# Altium schematic sheet schematic.schdoc
size 190 x 158 mm
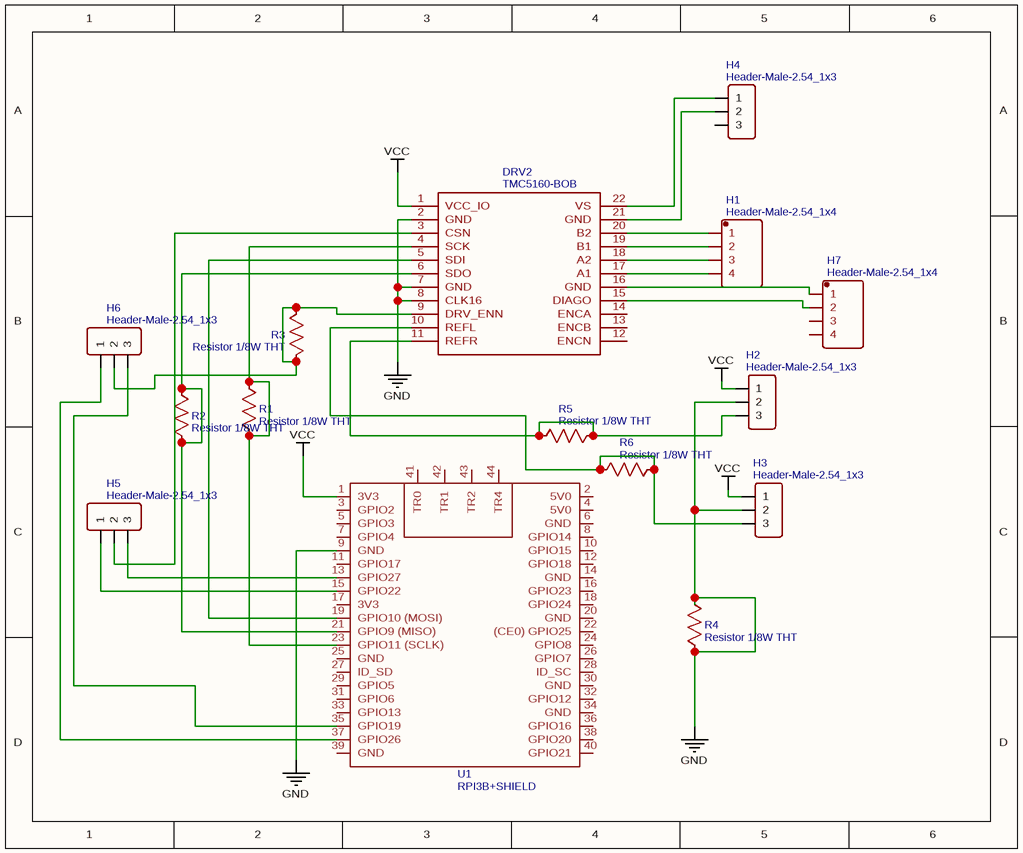
[diagram p0: schematic.schdoc]

## Parts
DRV2  TMC5160-BOB  [TMC5160-BOB]
H1  Header-Male-2.54_1x4  [HDR-TH_4P-P2.54-V]
H2  Header-Male-2.54_1x3  [HDR-TH_3P-P2.54-V]
H3  Header-Male-2.54_1x3  [HDR-TH_3P-P2.54-V]
H4  Header-Male-2.54_1x3  [HDR-TH_3P-P2.54-V]
H5  Header-Male-2.54_1x3  [HDR-TH_3P-P2.54-V]
H6  Header-Male-2.54_1x3  [HDR-TH_3P-P2.54-V]
H7  Header-Male-2.54_1x4  [HDR-TH_4P-P2.54-V]
R1  Resistor 1/8W THT  [RESISTOR 1/8W THT]
R2  Resistor 1/8W THT  [RESISTOR 1/8W THT]
R3  Resistor 1/8W THT  [RESISTOR 1/8W THT]
R4  Resistor 1/8W THT  [RESISTOR 1/8W THT]
R5  Resistor 1/8W THT  [RESISTOR 1/8W THT]
R6  Resistor 1/8W THT  [RESISTOR 1/8W THT]
U1  RPI3B+SHIELD  [RPI3B+SHIELD]

## Nets
GND: DRV2.2(GND) DRV2.7(GND) DRV2.8(CLK16) H2.2 H3.2 R4.1 R4.2 U1.9(GND)
VCC: DRV2.1(VCC_IO) H2.1 H3.1 U1.1(3V3)
NetDRV2_3: DRV2.3(CSN) H5.2
NetDRV2_4: DRV2.4(SCK) R1.1 R1.2 U1.23(GPIO11_(SCLK))
NetDRV2_5: DRV2.5(SDI) U1.19(GPIO10_(MOSI))
NetDRV2_6: DRV2.6(SDO) R2.1 R2.2 U1.21(GPIO9_(MISO))
NetDRV2_9: DRV2.9(DRV_ENN) H6.2 R3.1 R3.2
NetDRV2_10: DRV2.10(REFL) H3.3 R6.1 R6.2
NetDRV2_11: DRV2.11(REFR) H2.3 R5.1 R5.2
NetDRV2_15: DRV2.15(DIAGO) H7.2
NetDRV2_16: DRV2.16(GND) H7.1
NetDRV2_17: DRV2.17(A1) H1.4
NetDRV2_18: DRV2.18(A2) H1.3
NetDRV2_19: DRV2.19(B1) H1.2
NetDRV2_20: DRV2.20(B2) H1.1
NetDRV2_21: DRV2.21(GND) H4.2
NetDRV2_22: DRV2.22(VS) H4.1
NetH5_1: H5.1 U1.15(GPIO22)
NetH5_3: H5.3 U1.13(GPIO27)
NetH6_1: H6.1 U1.37(GPIO26)
NetH6_3: H6.3 U1.35(GPIO19)

Not connected (* = marked no-connect by the designer): DRV2 12(ENCN) 13(ENCB) 14(ENCA); H4 3; H7 3 4; U1 2(5V0) 3(GPIO2) 4(5V0) 5(GPIO3) 6(GND) 7(GPIO4) 8(GPIO14) 10(GPIO15) 11(GPIO17) 12(GPIO18) 14(GND) 16(GPIO23) 17(3V3) 18(GPIO24) 20(GND) 22((CE0)_GPIO25) 24(GPIO8) 25(GND) 26(GPIO7) 27(ID_SD) 28(ID_SC) 29(GPIO5) 30(GND) 31(GPIO6) 32(GPIO12) 33(GPIO13) 34(GND) 36(GPIO16) 38(GPIO20) 39(GND) 40(GPIO21) 41(TR0) 42(TR1) 43(TR2) 44(TR4)

## Library data of the parts
DRV2 = TMC5160-BOB: BOM_Manufacturer: TRINAMIC MOTION CONTROL GmbH; Contributor: alexackerman96; spicePre: D; spiceSymbolName: TMC5160-BOB
H1 H7 = Header-Male-2.54_1x4: BOM_Manufacturer: Ckmtw; BOM_Manufacturer Part: 210S-1*4P L=11.6MMGold-plated black; Contributor: LCSC; BOM_Supplier: LCSC; BOM_Supplier Part: C124378; spicePre: H; spiceSymbolName: Header-Male-2.54_1x4
H2-H6 = Header-Male-2.54_1x3: BOM_Manufacturer: BOOMELE; BOM_Manufacturer Part: Header2.54mm 1*3P; BOM_Supplier: LCSC; image: //image.lceda.cn/szlcsc/C49257.jpg; BOM_Supplier Part: C49257; spicePre: H; spiceSymbolName: Header-Male-2.54_1x3
R1-R6 = Resistor 1/8W THT: BOM_Manufacturer: Generic; Contributor: tyvogelpohl; BOM_Manufacturer Part: Generic; BOM_Supplier: Mouser; BOM_Supplier Part: Generic; spicePre: R; spiceSymbolName: Resistor 1/8W THT
U1 = RPI3B+SHIELD: BOM_Manufacturer Part: RaspberryPi 3; Contributor: gdevries; spicePre: U; spiceSymbolName: RPI3B+SHIELD